# EAGLE board board2-d (EAGLE 6.6.0), part 1 of 2
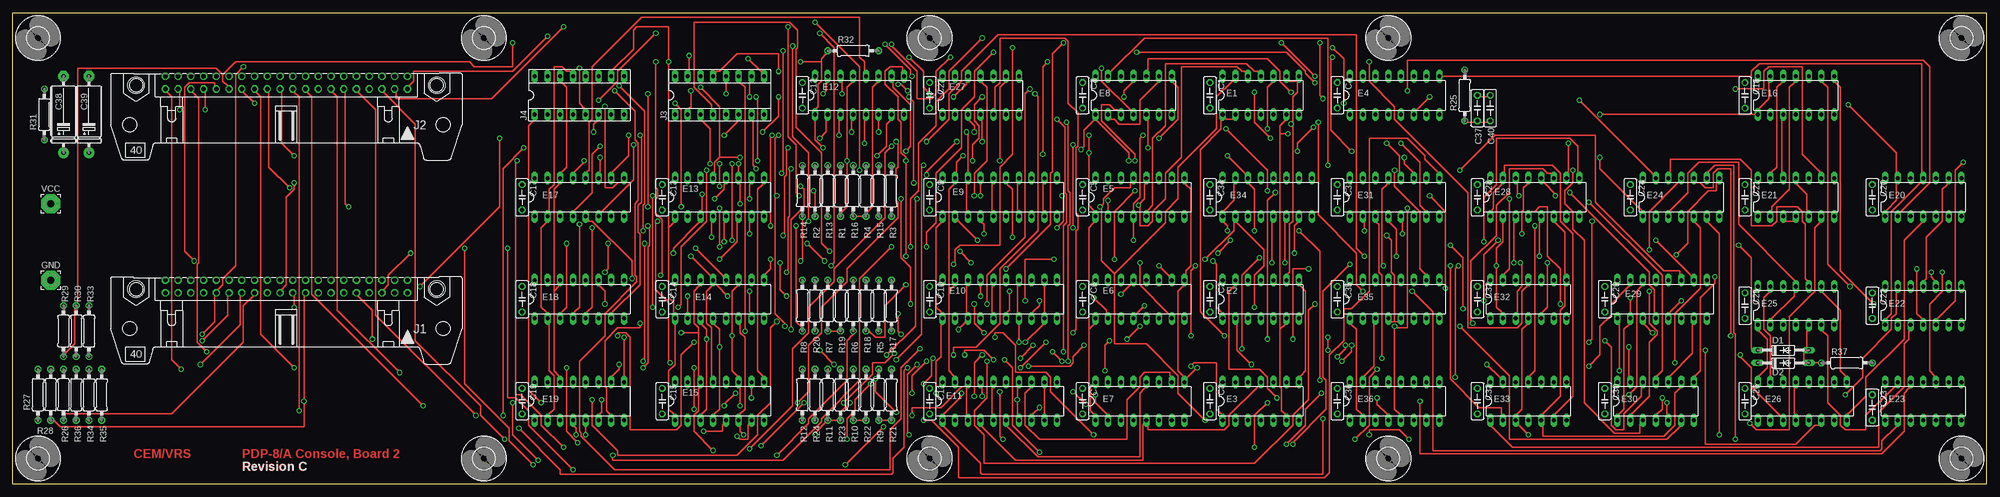
[diagram p4: board, top side]
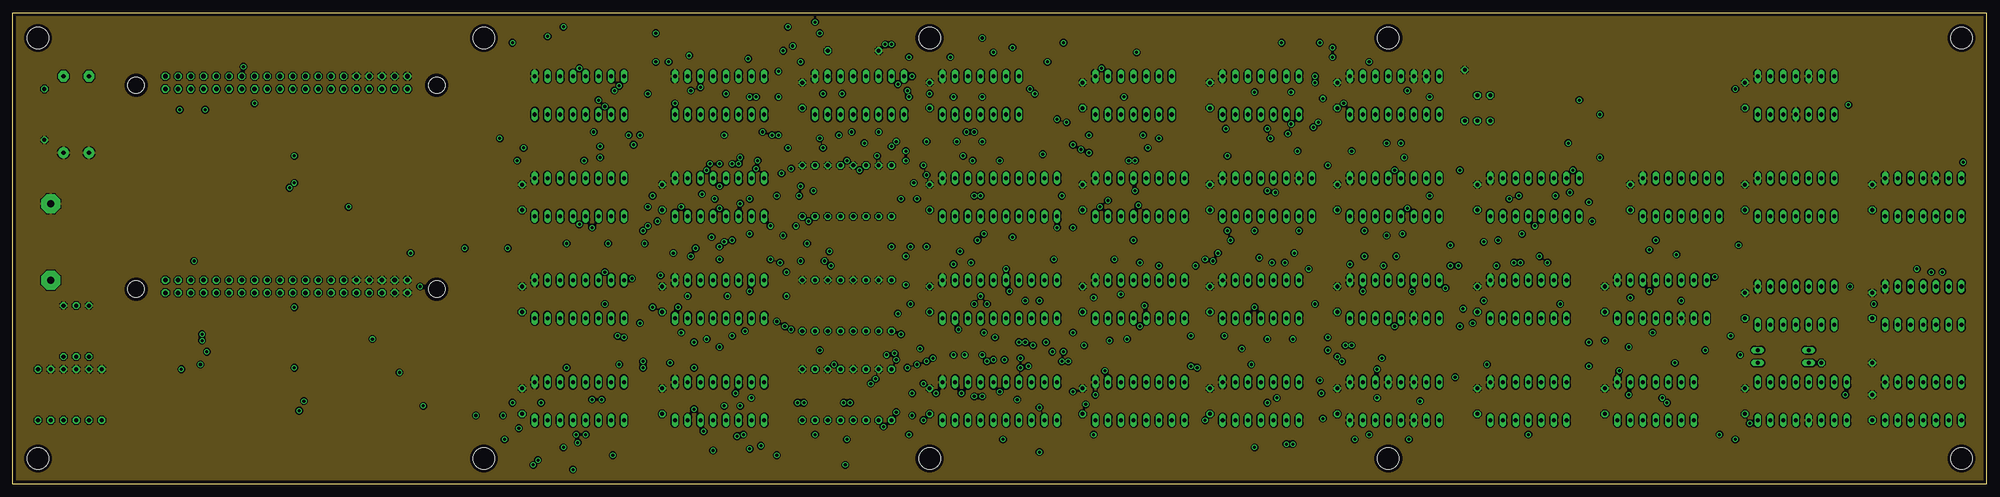
[diagram p5: board, inner layer VCC$]
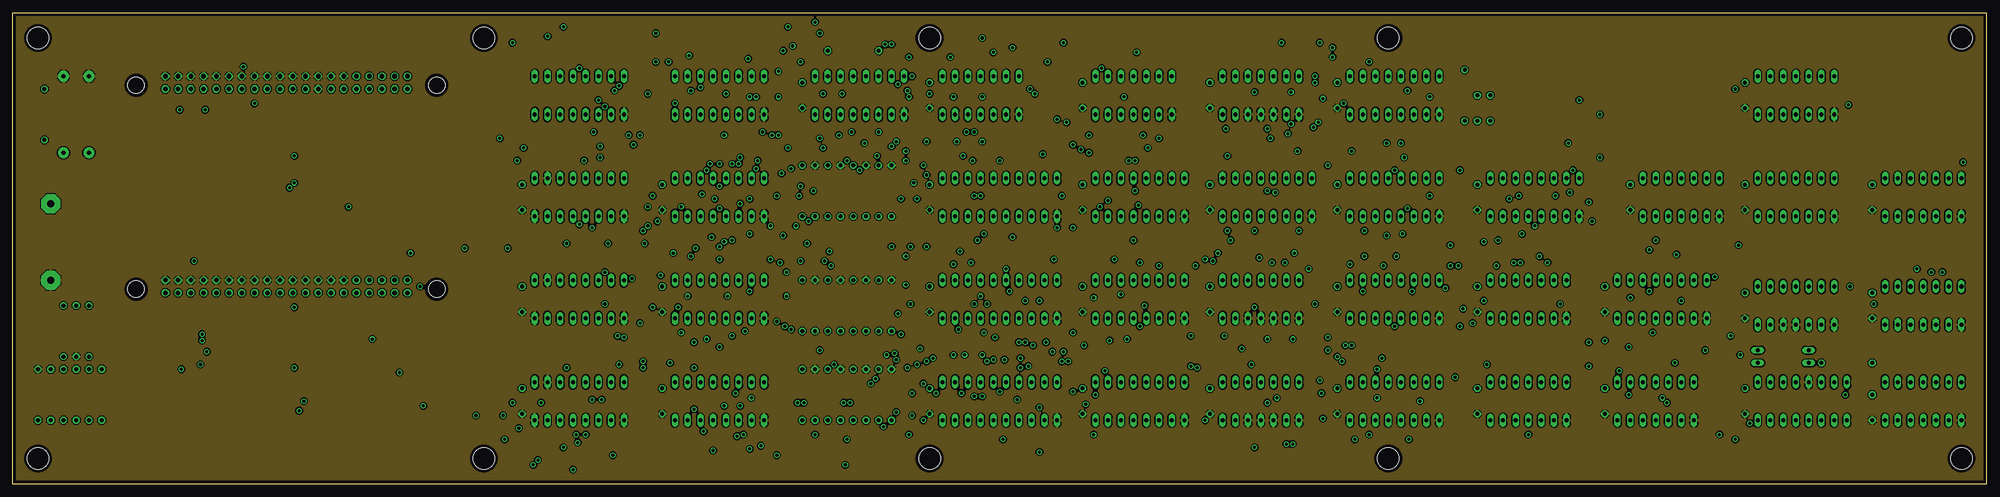
[diagram p6: board, inner layer GND$]
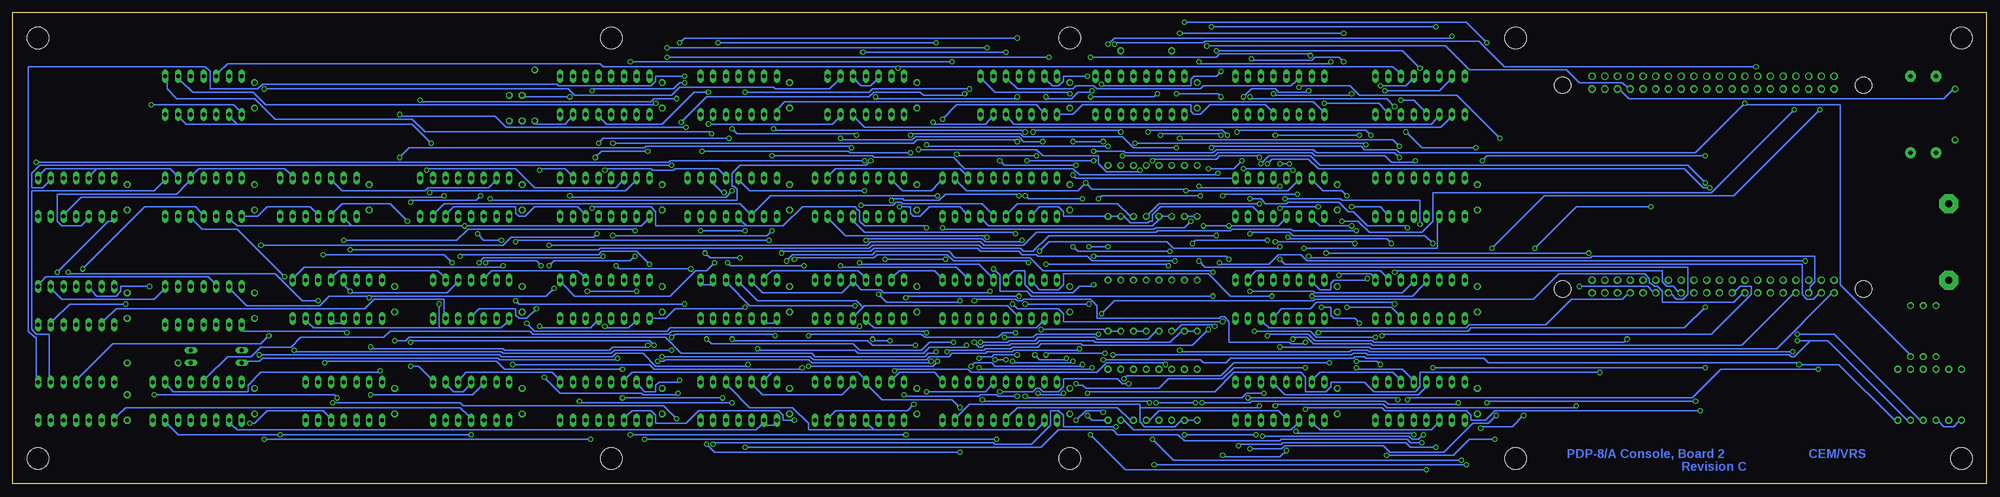
[diagram p7: board, bottom side, seen from below]

Size 393.7 x 93.98 mm. Coordinates in mm from the lower left corner, seen from the top.
Outline: 0,0 0,93.98 393.7,93.98 393.7,0 0,0
Copper layers (1*2*3*16): Top 0.035mm / dielectric 1.5mm / VCC$ 0.035mm / dielectric 0.15mm / GND$ 0.035mm / dielectric 0.2mm / Bottom 0.035mm
Design rules "10mils *": minimum track width 10mil, minimum drill 24mil, track to track 10mil, track to pad 10mil, pad to pad 10mil, via to via 10mil, smd to smd 10mil, copper to edge 25mil, drill to drill 10mil, minimum pad ring 10mil, minimum via ring 8mil, stop-mask expansion 0mil, vias tented up to drill 0mil, thermal gap 10mil
Net classes: 1 Supply: width 0.508 mm

## Footprints (pad centres in the part's own frame; a part is rotated, then mirrored left to right if it is on the bottom)
C050-025X075 = drill 0.813 octagon: 1 -2.54,0; 2 2.54,0
E15-5 = drill 0.813 pad 2.159: + -7.62,0 | drill 0.813 pad 2.159 octagon: - 7.62,0
DO35-10 = drill 0.813 long: A 5.08,0; C -5.08,0
DIL14 = drill 0.813 long: 1 -7.62,-3.81; 2 -5.08,-3.81; 3 -2.54,-3.81; 4 0,-3.81; 5 2.54,-3.81; 6 5.08,-3.81; 7 7.62,-3.81; 8 7.62,3.81; 9 5.08,3.81; 10 2.54,3.81; 11 0,3.81; 12 -2.54,3.81; 13 -5.08,3.81; 14 -7.62,3.81
DIL16 = drill 0.813 long: 1 -8.89,-3.81; 2 -6.35,-3.81; 3 -3.81,-3.81; 4 -1.27,-3.81; 5 1.27,-3.81; 6 3.81,-3.81; 7 6.35,-3.81; 8 8.89,-3.81; 9 8.89,3.81; 10 6.35,3.81; 11 3.81,3.81; 12 1.27,3.81; 13 -1.27,3.81; 14 -3.81,3.81; 15 -6.35,3.81; 16 -8.89,3.81
DIL20 = drill 0.813 long: 1 -11.43,-3.81; 2 -8.89,-3.81; 3 -6.35,-3.81; 4 -3.81,-3.81; 5 -1.27,-3.81; 6 1.27,-3.81; 7 3.81,-3.81; 8 6.35,-3.81; 9 8.89,-3.81; 10 11.43,-3.81; 11 11.43,3.81; 12 8.89,3.81; 13 6.35,3.81; 14 3.81,3.81; 15 1.27,3.81; 16 -1.27,3.81; 17 -3.81,3.81; 18 -6.35,3.81; 19 -8.89,3.81; 20 -11.43,3.81
3,81/1,4 = drill 1.397 pad 3.81 octagon: 1 0,0
40H = drill 0.914: 1 -24.13,-1.27 | drill 0.914 octagon: 2 -24.13,1.27; 3 -21.59,-1.27; 4 -21.59,1.27; 5 -19.05,-1.27; 6 -19.05,1.27; 7 -16.51,-1.27; 8 -16.51,1.27; 9 -13.97,-1.27; 10 -13.97,1.27; 11 -11.43,-1.27; 12 -11.43,1.27; 13 -8.89,-1.27; 14 -8.89,1.27; 15 -6.35,-1.27; 16 -6.35,1.27; 17 -3.81,-1.27; 18 -3.81,1.27; 19 -1.27,-1.27; 20 -1.27,1.27; 21 1.27,-1.27; 22 1.27,1.27; 23 3.81,-1.27; 24 3.81,1.27; 25 6.35,-1.27; 26 6.35,1.27; 27 8.89,-1.27; 28 8.89,1.27; 29 11.43,-1.27; 30 11.43,1.27; 31 13.97,-1.27; 32 13.97,1.27; 33 16.51,-1.27; 34 16.51,1.27; 35 19.05,-1.27; 36 19.05,1.27; 37 21.59,-1.27; 38 21.59,1.27; 39 24.13,-1.27; 40 24.13,1.27 | hole 3.302: -29.972,0.533; 29.972,0.533
SOCKED-16 = drill 0.813 long: 1 -8.89,-3.81; 2 -6.35,-3.81; 3 -3.81,-3.81; 4 -1.27,-3.81; 5 1.27,-3.81; 6 3.81,-3.81; 7 6.35,-3.81; 8 8.89,-3.81; 9 8.89,3.81; 10 6.35,3.81; 11 3.81,3.81; 12 1.27,3.81; 13 -1.27,3.81; 14 -3.81,3.81; 15 -6.35,3.81; 16 -8.89,3.81
0207/10 = drill 0.813 octagon: 1 -5.08,0; 2 5.08,0
4,3 = hole 4.3: 0,0

## Placement (x,y rotation side)
C1  [C050-025X075]  238.76,77.47 270 top
C2  [C050-025X075]  238.76,36.83 270 top
C3  [C050-025X075]  238.76,16.51 270 top
C4  [C050-025X075]  264.16,77.47 270 top
C5  [C050-025X075]  213.36,57.15 270 top
C6  [C050-025X075]  213.36,36.83 270 top
C7  [C050-025X075]  213.36,16.51 270 top
C8  [C050-025X075]  213.36,77.47 270 top
C9  [C050-025X075]  182.88,57.15 270 top
C10  [C050-025X075]  182.88,36.83 270 top
C11  [C050-025X075]  182.88,16.51 270 top
C12  [C050-025X075]  157.48,77.47 270 top
C13  [C050-025X075]  129.54,57.15 270 top
C14  [C050-025X075]  129.54,36.83 270 top
C15  [C050-025X075]  129.54,16.51 270 top
C16  [C050-025X075]  345.44,77.47 270 top
C17  [C050-025X075]  101.6,57.15 270 top
C18  [C050-025X075]  101.6,36.83 270 top
C19  [C050-025X075]  101.6,16.51 270 top
C20  [C050-025X075]  370.84,57.15 270 top
C21  [C050-025X075]  345.44,57.15 270 top
C22  [C050-025X075]  370.84,35.56 270 top
C23  [C050-025X075]  370.84,15.24 270 top
C24  [C050-025X075]  322.58,57.15 270 top
C25  [C050-025X075]  345.44,35.56 270 top
C26  [C050-025X075]  345.44,16.51 270 top
C27  [C050-025X075]  182.88,77.47 270 top
C28  [C050-025X075]  292.1,57.15 270 top
C29  [C050-025X075]  317.5,36.83 270 top
C30  [C050-025X075]  317.5,16.51 270 top
C31  [C050-025X075]  264.16,57.15 270 top
C32  [C050-025X075]  292.1,36.83 270 top
C33  [C050-025X075]  292.1,16.51 270 top
C34  [C050-025X075]  238.76,57.15 270 top
C35  [C050-025X075]  264.16,36.83 270 top
C36  [C050-025X075]  264.16,16.51 270 top
C37  10  [C050-025X075]  292.1,74.93 90 top
C38  6.8uf  [E15-5]  10.16,73.66 90 top
C39  6.8uf  [E15-5]  15.24,73.66 90 top
C40  47  [C050-025X075]  294.64,74.93 90 top
D1  1N4148  [DO35-10]  353.06,26.67 0 top
D2  1N4148  [DO35-10]  353.06,24.13 0 top
E1  74LS95N  [DIL14]  248.92,77.47 0 top
E2  74LS95N  [DIL14]  248.92,36.83 0 top
E3  74LS95N  [DIL14]  248.92,16.51 0 top
E4  74LS123N  [DIL16]  275.59,77.47 0 top
E5  74LS175N  [DIL16]  224.79,57.15 0 top
E6  74LS175N  [DIL16]  224.79,36.83 0 top
E7  74LS175N  [DIL16]  224.79,16.51 0 top
E8  74LS00N  [DIL14]  223.52,77.47 0 top
E9  74LS244N  [DIL20]  196.85,57.15 0 top
E10  74LS244N  [DIL20]  196.85,36.83 0 top
E11  74LS244N  [DIL20]  196.85,16.51 0 top
E12  74LS174N  [DIL16]  168.91,77.47 0 top
E13  74LS174N  [DIL16]  140.97,57.15 0 top
E14  74LS174N  [DIL16]  140.97,36.83 0 top
E15  74LS174N  [DIL16]  140.97,16.51 0 top
E16  74LS74N  [DIL14]  355.6,77.47 0 top
E17  74LS153N  [DIL16]  113.03,57.15 0 top
E18  74LS153N  [DIL16]  113.03,36.83 0 top
E19  74LS153N  [DIL16]  113.03,16.51 0 top
E20  74LS74N  [DIL14]  381,57.15 0 top
E21  74LS27N  [DIL14]  355.6,57.15 0 top
E22  74LS02N  [DIL14]  381,35.56 0 top
E23  7416N  [DIL14]  381,16.51 0 top
E24  74LS04N  [DIL14]  332.74,57.15 0 top
E25  74LS27N  [DIL14]  355.6,35.56 0 top
E26  74LS75N  [DIL16]  356.87,16.51 0 top
E27  7404N  [DIL14]  193.04,77.47 0 top
E28  74LS367N  [DIL16]  303.53,57.15 0 top
E29  74LS138N  [DIL16]  328.93,36.83 0 top
E30  74LS00N  [DIL14]  327.66,16.51 0 top
E31  74LS367N  [DIL16]  275.59,57.15 0 top
E32  74LS08N  [DIL14]  302.26,36.83 0 top
E33  74LS02N  [DIL14]  302.26,16.51 0 top
E34  74LS367N  [DIL16]  250.19,57.15 0 top
E35  74LS138N  [DIL16]  275.59,36.83 0 top
E36  74LS174N  [DIL16]  275.59,16.51 0 top
GND  [3,81/1,4]  7.62,40.64 0 top
J1  [40H]  54.61,39.37 180 top
J2  [40H]  54.61,80.01 180 top
J3  [SOCKED-16]  140.97,77.47 0 top
J4  [SOCKED-16]  113.03,77.47 0 top
R1  680  [0207/10]  165.1,58.42 270 top
R2  680  [0207/10]  160.02,58.42 270 top
R3  680  [0207/10]  175.26,58.42 270 top
R4  680  [0207/10]  170.18,58.42 270 top
R5  330  [0207/10]  172.72,35.56 90 top
R6  330  [0207/10]  167.64,35.56 90 top
R7  330  [0207/10]  162.56,35.56 90 top
R8  330  [0207/10]  157.48,35.56 90 top
R9  330  [0207/10]  172.72,17.78 90 top
R10  330  [0207/10]  167.64,17.78 90 top
R11  330  [0207/10]  162.56,17.78 90 top
R12  330  [0207/10]  157.48,17.78 90 top
R13  330  [0207/10]  162.56,58.42 90 top
R14  330  [0207/10]  157.48,58.42 90 top
R15  330  [0207/10]  172.72,58.42 90 top
R16  330  [0207/10]  167.64,58.42 90 top
R17  680  [0207/10]  175.26,35.56 270 top
R18  680  [0207/10]  170.18,35.56 270 top
R19  680  [0207/10]  165.1,35.56 270 top
R20  680  [0207/10]  160.02,35.56 270 top
R21  680  [0207/10]  175.26,17.78 270 top
R22  680  [0207/10]  170.18,17.78 270 top
R23  680  [0207/10]  165.1,17.78 270 top
R24  680  [0207/10]  160.02,17.78 270 top
R25  6K8  [0207/10]  289.56,77.47 270 top
R26  180  [0207/10]  10.16,17.78 90 top
R27  390  [0207/10]  5.08,17.78 270 top
R28  1K  [0207/10]  7.62,17.78 90 top
R29  180  [0207/10]  10.16,30.48 90 top
R30  390  [0207/10]  12.7,30.48 90 top
R31  1K  [0207/10]  6.35,73.66 270 top
R32  1K  [0207/10]  167.64,86.36 0 top
R33  1K  [0207/10]  15.24,30.48 90 top
R34  1K  [0207/10]  15.24,17.78 270 top
R35  1K  [0207/10]  17.78,17.78 270 top
R36  1K  [0207/10]  12.7,17.78 270 top
R37  10K  [0207/10]  365.76,24.13 0 top
U$11  [4,3]  93.98,88.9 0 top
U$12  [4,3]  5.08,88.9 0 top
U$13  [4,3]  182.88,88.9 0 top
U$14  [4,3]  274.32,88.9 0 top
U$15  [4,3]  388.62,88.9 0 top
U$16  [4,3]  388.62,5.08 0 top
U$17  [4,3]  274.32,5.08 0 top
U$18  [4,3]  182.88,5.08 0 top
U$19  [4,3]  93.98,5.08 0 top
U$20  [4,3]  5.08,5.08 0 top
VCC  [3,81/1,4]  7.62,55.88 0 top

## Tracks (layer width: path | path; a pad name or v marks a point on that pad's centre or on a via)
!ADRLTH  (via drill 0.61)
  Top 0.254: v151.13,44.77 151.13,42.86 150.18,41.91 E14.9 | v178.12,45.4 v178.12,64.45 178.12,65.09 177.16,66.04 177.16,72.07 176.53,72.71 176.53,77.15 173.99,79.69 173.99,82.23 174.94,83.19 177.48,83.19 177.48,82.55 E12.9 | v221.62,77.15 221.62,78.42 223.2,80.01 E8.11 | v193.36,77.15 191.77,75.56 191.77,72.39 192.72,71.44 192.72,68.9 191.45,67.63 v191.45,64.45
  Bottom 0.254: v151.13,44.77 151.76,45.4 v178.12,45.4 | v221.62,77.15 221.3,76.83 193.68,76.83 v193.36,77.15 | v191.45,64.45 v178.12,64.45
!BFSW  (via drill 0.61)
  Top 0.254: v293.37,48.26 293.37,57.15 295.91,59.69 295.91,68.9 310.51,68.9 312.1,67.31 312.1,62.23 E28.9 | v240.35,46.04 v242.89,48.58 | v161.93,44.45 v158.43,47.94 | v143.51,48.58 v143.51,63.82 | v55.24,59.05 51.12,63.18 51.12,78.11 J2.24
  Bottom 0.254: v293.37,48.26 293.05,48.58 v242.89,48.58 | v240.35,46.04 240.03,46.35 222.57,46.35 221.93,46.99 201.29,46.99 200.66,46.35 193.04,46.35 192.41,45.72 189.55,45.72 189.23,45.4 179.39,45.4 178.44,44.45 v161.93,44.45 | v158.43,47.94 157.8,48.58 v143.51,48.58 | v143.51,63.82 142.56,64.77 135.25,64.77 133.35,62.87 60.33,62.87 56.52,59.05 v55.24,59.05
!BKDTACNTL  (via drill 0.61)
  Top 0.254: v299.4,44.13 299.4,52.07 E28.3 | v288.29,43.5 287.65,42.86 v287.65,21.27 | v260.99,18.1 257.81,14.92 257.81,11.75 v254,7.94 | v173.67,11.43 v166.05,3.81 | v103.82,3.81 99.06,8.57 99.06,11.11 90.17,20 v90.17,46.99 | v66.99,55.24 66.36,55.88 66.36,78.11 J2.12
  Bottom 0.254: v299.4,44.13 299.08,44.45 289.24,44.45 v288.29,43.5 | v287.65,21.27 284.48,18.1 268.29,18.1 267.97,17.78 261.3,17.78 v260.99,18.1 | v254,7.94 253.68,8.26 198.12,8.26 197.8,7.94 190.5,7.94 186.69,11.75 186.69,14.61 185.1,14.61 184.15,13.65 184.15,11.43 v173.67,11.43 | v166.05,3.81 v103.82,3.81 | v90.17,46.99 81.92,55.24 v66.99,55.24
!BOOTF  (via drill 0.61)
  Top 0.254: v310.2,67.94 310.2,62.23 E28.10
  Bottom 0.254: v310.2,67.94 314.01,71.75 348.93,71.75 | 348.93,71.75 349.88,72.71 E16.2 | 348.93,71.75 359.09,71.75 360.05,72.71 E16.6
!BUSEN  (via drill 0.61)
  Top 0.254: v223.84,58.42 219.71,54.29 v219.71,44.77 | v207.65,44.77 201.93,44.77 v201.93,36.51 | v135.89,28.26 133.35,25.72 133.35,11.75 132.4,10.79 123.19,10.79 123.19,29.21 122.24,30.16 120.65,30.16 v120.65,29.53
  Bottom 0.254: v223.84,58.42 246.7,58.42 248.28,60.01 E34.13 | v219.71,44.77 v207.65,44.77 | v201.93,36.51 201.61,36.83 193.68,36.83 193.36,36.51 192.41,36.51 192.09,36.83 178.75,36.83 177.48,35.56 177.48,33.02 153.03,33.02 152.72,33.34 152.08,33.34 151.13,32.38 151.13,28.26 139.06,28.26 138.75,27.94 136.21,27.94 v135.89,28.26 | v120.65,29.53 120.33,29.84 54.93,29.84 46.99,37.78 46.99,39.37 49.21,39.37 50.16,38.42 J1.24
!DEP  (via drill 0.61)
  Top 0.254: v304.48,45.4 304.48,52.07 E28.5 | v266.7,43.81 261.3,38.42 261.3,21.27 261.94,20.64 261.94,14.92 255.27,8.26 v255.27,7.94 | v204.79,6.35 199.39,11.75 199.39,23.18 v197.8,24.77 | v195.58,24.77 193.68,26.67 189.87,26.67 v189.87,25.72 | v183.51,25.08 183.2,24.77 183.2,21.59 v181.61,20 | v135.89,23.18 v135.89,14.92 | v57.15,14.61 57.15,77.15 56.2,78.11 J2.20
  Bottom 0.254: v304.48,45.4 304.17,45.72 276.86,45.72 276.23,46.35 269.24,46.35 v266.7,43.81 | v255.27,7.94 253.68,6.35 v204.79,6.35 | v197.8,24.77 v195.58,24.77 | v189.87,25.72 188.91,24.77 183.83,24.77 v183.51,25.08 | v181.61,20 181.29,19.68 180.34,19.68 179.71,19.05 165.1,19.05 163.19,20.95 152.4,20.95 150.18,23.18 v135.89,23.18 | v135.89,14.92 135.57,15.24 120.65,15.24 120.02,14.61 103.82,14.61 102.87,13.65 102.87,12.7 100.01,12.7 98.11,14.61 v57.15,14.61
!DSPLTH  (via drill 0.61)
  Top 0.254: E15.9 149.54,21.59 148.59,22.54 148.59,58.74 149.54,59.69 E13.9 | v228.6,68.9 232.41,72.71 232.41,79.06 231.46,80.01 E8.8 | v188.28,68.26 182.25,62.23 v182.25,61.59
  Bottom 0.254: v228.6,68.9 228.28,68.58 214.31,68.58 213.68,69.22 193.04,69.22 192.09,68.26 v188.28,68.26 | v182.25,61.59 181.61,60.96 E13.9
!EMA0  (via drill 0.61)
  Top 0.254: v37.78,28.57 42.86,33.66 42.86,37.47 J1.30 | v191.77,57.47 191.77,61.91 194.31,64.45 194.31,79.06 193.36,80.01 E27.11 | v180.34,56.83 180.02,56.52 180.02,31.43 v174.31,25.72
  Bottom 0.254: 35.24,28.57 v37.78,28.57 | 35.24,28.57 31.75,28.57 15.88,12.7 R34.2 | v191.77,57.47 191.13,56.83 v180.34,56.83 | v174.31,25.72 126.68,25.72 126.36,26.04 123.83,26.04 123.51,25.72 39.37,25.72 39.05,25.4 38.42,25.4 35.24,28.57
!EMA1  (via drill 0.61)
  Top 0.254: v37.47,23.81 45.4,31.75 45.4,37.47 J1.28 | v196.85,64.45 196.85,79.06 197.8,80.01 E27.9 | v181.61,63.5 181.29,63.18 181.29,29.84 v176.21,24.77
  Bottom 0.254: R35.2 18.41,12.7 29.53,23.81 v37.47,23.81 37.78,24.13 99.38,24.13 100.33,25.08 123.83,25.08 124.14,25.4 126.05,25.4 126.36,25.08 150.81,25.08 151.76,24.13 156.21,24.13 156.84,24.77 v176.21,24.77 | v196.85,64.45 195.9,63.5 v181.61,63.5
!EMA2  (via drill 0.61)
  Top 0.254: v37.78,29.84 40.32,32.38 40.32,37.47 J1.32 40.96,38.73 41.91,39.69 41.91,40.96 44.45,43.5 44.45,81.6 v46.04,83.19 | v179.39,81.28 179.07,81.6 179.07,82.55 v173.99,87.63
  Bottom 0.254: v37.78,29.84 30.48,29.84 13.34,12.7 R36.2 | v179.39,81.28 184.15,81.28 184.15,80.33 185.1,79.38 186.37,79.38 187.32,80.33 E27.13 | v173.99,87.63 173.67,87.95 156.21,87.95 155.89,88.27 101.28,88.27 96.2,83.19 v46.04,83.19
!EMODE  (via drill 0.61)
  Top 0.254: 252.73,30.8 252.73,19.37 253.05,19.05 253.05,14.61 253.68,13.97 E3.6 | 252.73,30.8 253.68,31.75 E2.6 | 252.73,30.8 252.73,69.85 | 252.73,69.85 252.73,71.44 253.68,72.39 E1.6 | v371.16,35.88 364.49,42.55 364.49,79.06 363.54,80.01 E16.8 | 252.73,69.85 v254.32,69.85
  Bottom 0.254: v371.16,35.88 382.27,35.88 385.44,32.7 E22.6 | v254.32,69.85 254.63,70.17 311.47,70.17 314.01,72.71 341.31,72.71 345.44,76.83 361,76.83 362.9,78.74 362.9,80.01 E16.8
!FUN  (via drill 0.61)
  Top 0.254: E25.2 350.84,33.02 355.28,37.47 355.28,38.1 E25.11 355.28,40.64 344.17,51.75 344.17,64.14 336.23,64.14 334.01,61.91 334.01,58.1 330.52,54.61 E24.3 | v120.02,78.42 124.14,74.3 124.14,68.58 124.78,67.94 124.78,56.52 124.14,55.88 124.14,41.59 124.46,41.27 124.46,40.32 118.11,33.97 118.11,29.53 113.03,24.45 113.03,10.48 113.35,10.16 113.35,9.53 120.02,2.86 174.94,2.86 174.94,10.79 177.16,13.02 177.16,23.18 v180.97,26.99 | v264.16,25.4 265.75,26.99 v265.75,27.62 | v314.32,28.26 314.96,28.89 v314.96,52.39
  Bottom 0.254: v120.02,78.42 109.22,78.42 107.31,80.33 J4.15 | v180.97,26.99 181.29,26.67 193.99,26.67 194.31,26.35 199.39,26.35 199.71,26.04 206.38,26.04 207.01,25.4 210.82,25.4 211.46,24.77 234,24.77 234.63,25.4 v264.16,25.4 | v265.75,27.62 266.7,28.57 314.01,28.57 v314.32,28.26 | v314.96,52.39 318.45,55.88 327.98,55.88 329.56,54.29 E24.3
!GATEENT  (via drill 0.61)
  Top 0.254: v189.23,18.1 189.23,17.46 185.74,13.97 E11.1 185.74,11.43 193.04,4.13 193.04,2.22 193.36,1.91 261.3,1.91 v261.3,13.02 | v184.15,18.1 184.15,24.45 185.1,25.4 185.1,31.75 E10.1 185.1,34.29 184.15,35.24 184.15,51.12 185.1,52.07 E9.1 | v346.39,12.06 347.66,10.79 354.33,10.79 354.33,33.34 359.41,38.42 359.41,51.12 360.36,52.07 E21.6 | v329.88,16.19 329.88,13.97 E30.5
  Bottom 0.254: v189.23,18.1 188.91,17.78 184.47,17.78 v184.15,18.1 | v346.39,12.06 345.44,12.06 342.9,14.61 331.79,14.61 330.83,13.65 E30.5 | v261.3,13.02 263.84,15.56 303.85,15.56 304.48,16.19 v329.88,16.19
!GATESR  (via drill 0.61)
  Top 0.254: 186.69,38.42 186.69,22.54 187.64,21.59 E11.19 | 186.69,38.42 187.64,39.37 E10.19 | 186.69,38.42 186.69,58.74 187.64,59.69 E9.19 188.28,62.23 188.28,64.14 v189.55,65.41 | v270.51,84.14 270.51,80.33 275.59,75.25 275.59,72.71 290.19,58.1 290.19,31.11 300.04,31.11 300.99,32.07 300.99,38.42 301.94,39.37 E32.11 | v206.38,84.14 205.42,83.19 v205.42,65.72
  Bottom 0.254: v206.38,84.14 v270.51,84.14 | v205.42,65.72 205.1,65.41 v189.55,65.41
!IND1  (via drill 0.61)
  Top 0.254: v155.57,87.31 155.57,69.22 158.75,66.04 v158.75,52.39 | v208.28,51.12 209.55,52.39 209.55,57.15 v209.23,57.47
  Bottom 0.254: E28.7 309.25,54.29 307.66,55.88 248.6,55.88 247.01,54.29 E34.3 245.75,54.29 242.57,57.47 v209.23,57.47 | v155.57,87.31 107.95,87.31 103.19,82.55 83.82,82.55 81.28,80.01 72.71,80.01 71.75,79.06 J2.8 | v158.75,52.39 160.02,51.12 165.74,51.12 166.05,50.8 207.96,50.8 v208.28,51.12
!IND2  (via drill 0.61)
  Top 0.254: v251.14,44.13 251.14,52.07 E34.5 | v235.9,43.5 234.95,42.55 v234.95,29.53 | v193.68,30.16 191.77,32.07 v191.77,35.88 | v179.07,35.88 179.07,43.18 177.16,45.09 v177.16,56.83 | v156.84,57.47 156.21,58.1 156.21,67.63 154.62,69.22 v154.62,91.12 | v109.86,91.12 95.57,76.83 76.52,76.83 76.52,78.11 J2.4
  Bottom 0.254: v251.14,44.13 250.51,43.5 v235.9,43.5 | v234.95,29.53 234.63,29.84 212.41,29.84 211.77,29.21 197.17,29.21 196.22,30.16 v193.68,30.16 | v191.77,35.88 v179.07,35.88 | v177.16,56.83 176.53,57.47 v156.84,57.47 | v154.62,91.12 v109.86,91.12
!INIT  (via drill 0.61)
  Top 0.254: v181.61,12.7 183.2,12.7 188.59,7.3 188.59,1.27 261.62,1.27 262.57,2.22 262.57,25.72 265.43,28.57 265.43,34.92 267.02,34.92 270.51,38.42 270.51,68.9 278.13,68.9 281.62,65.41 281.62,64.77 284.16,62.23 E31.9 | v176.21,14.29 172.09,18.41 v172.09,20.95 | v131.13,24.13 130.81,24.45 130.81,36.2 128.27,38.73 128.27,52.07 v128.59,52.39 | v38.42,74.61 38.42,78.11 J2.34
  Bottom 0.254: v181.61,12.7 179.71,14.61 176.53,14.61 v176.21,14.29 | v172.09,20.95 171.45,21.59 152.72,21.59 150.18,24.13 v131.13,24.13 | v128.59,52.39 125.41,52.39 123.19,50.16 112.71,50.16 110.49,52.39 110.49,58.1 54.93,58.1 v38.42,74.61
!KEY-F  (via drill 0.61)
  Top 0.254: E26.4 355.28,13.97 355.28,19.05 E26.13 | v211.46,30.16 212.09,30.8 212.09,50.48 212.41,50.8 212.41,53.66 212.09,53.98 212.09,66.99 212.41,67.31 212.41,73.98 210.5,75.88 210.5,88.27 209.87,88.9 196.85,88.9 196.85,80.01 195.9,79.06 195.9,74.93 E27.5
  Bottom 0.254: J4.3 109.86,72.71 110.81,71.75 193.99,71.75 194.94,72.71 E27.5 | v211.46,30.16 211.77,30.48 262.25,30.48 262.89,29.84 289.88,29.84 290.51,30.48 318.45,30.48 319.72,29.21 336.23,29.21 338.14,27.3 344.17,27.3 346.07,25.4 350.84,25.4 354.96,21.27 E26.13
!KEYCNTL  (via drill 0.61)
  Top 0.254: v273.37,43.5 273.05,43.81 273.05,58.74 274,59.69 E31.13 | v258.44,42.86 255.27,42.86 v255.27,28.89 | v206.06,28.26 v200.98,23.18 | v178.44,23.18 177.8,22.54 177.8,7.3 175.58,5.08 175.58,2.22 175.26,1.91 109.22,1.91 109.22,2.86 v100.97,11.11 | v92.39,13.65 72.39,33.66 72.39,74.61 68.9,78.11 J2.10
  Bottom 0.254: v273.37,43.5 272.73,42.86 v258.44,42.86 | v255.27,28.89 254.32,27.94 226.06,27.94 224.79,26.67 212.41,26.67 210.82,28.26 v206.06,28.26 | v200.98,23.18 200.66,22.86 178.75,22.86 v178.44,23.18 | v100.97,11.11 100.65,11.43 94.61,11.43 v92.39,13.65
!KEYSTB  (via drill 0.61)
  Top 0.254: E16.11 355.28,80.01 354.33,79.06 354.33,58.74 350.84,55.24 350.84,54.61 E21.2 | v303.53,51.44 303.53,22.54 302.58,21.59 E33.11
  Bottom 0.254: E33.11 302.89,19.37 303.85,18.41 305.75,18.41 306.7,19.37 E33.9 | 326.07,51.44 v303.53,51.44 268.29,51.44 267.33,52.39 E31.1 | 326.07,51.44 327.02,52.39 E24.2 | 326.07,51.44 348.93,51.44 349.88,52.39 E21.2
!KFUN0  (via drill 0.61)
  Top 0.254: v139.06,63.82 139.06,70.8 137.48,72.39 J3.3 | v140.97,59.37 v140.97,63.82 | v157.16,59.37 157.8,58.74 157.8,55.24 155.26,52.7 v155.26,30.8 | v209.23,24.45 v207.33,26.35 | v234.95,23.5 235.59,24.13 240.03,24.13 240.03,14.92 240.98,13.97 E3.1
  Bottom 0.254: E3.1 241.94,11.75 243.21,11.75 E3.2 244.47,11.75 245.43,10.79 348.93,10.79 349.88,11.75 E26.2 | v140.97,63.82 v139.06,63.82 | v140.97,59.37 141.29,59.05 156.84,59.05 v157.16,59.37 | v155.26,30.8 158.43,27.62 180.34,27.62 180.66,27.94 188.59,27.94 189.23,27.3 194.31,27.3 194.63,26.99 199.71,26.99 200.03,26.67 207.01,26.67 v207.33,26.35 | v209.23,24.45 210.19,23.5 v234.95,23.5
!KFUN1  (via drill 0.61)
  Top 0.254: v344.49,25.72 344.49,25.4 346.71,23.18 346.71,19.37 352.43,13.65 E26.3 | v247.01,23.81 244.16,26.67 244.16,31.75 E2.2 | v135.25,78.42 135.25,75.25 134.94,74.93 J3.2 | v148.27,77.15 148.59,76.83 v148.59,64.45 | v155.26,62.87 154.94,62.55 154.94,53.34 154.62,53.02 154.62,42.55 v154.31,42.23 | v239.4,44.45 240.03,43.81 240.03,35.24 240.98,34.29 E2.1
  Bottom 0.254: E2.1 241.94,32.07 243.21,32.07 E2.2 | v344.49,25.72 296.55,25.72 296.23,25.4 274,25.4 273.37,26.04 267.97,26.04 265.43,23.5 247.33,23.5 v247.01,23.81 | v135.25,78.42 135.57,78.11 141.29,78.11 141.92,78.74 146.69,78.74 v148.27,77.15 | v148.59,64.45 150.18,62.87 v155.26,62.87 | v154.31,42.23 154.62,42.55 188.28,42.55 190.82,45.09 205.74,45.09 207.01,46.35 221.62,46.35 222.25,45.72 238.12,45.72 v239.4,44.45
!KFUN2  (via drill 0.61)
  Top 0.254: E1.2 243.21,72.71 241.94,72.71 E1.1 240.98,72.39 240.98,70.8 236.85,66.67 236.85,34.29 v241.62,29.53 | v337.5,26.67 337.5,7.94 355.6,7.94 359.41,11.75 360.05,11.75 E26.6 | v262.25,29.21 v262.25,26.67
  Bottom 0.254: J3.1 132.72,74.61 134.3,76.2 239.71,76.2 240.98,74.93 E1.1 | v337.5,26.67 337.19,26.35 296.23,26.35 295.91,26.04 274.32,26.04 273.69,26.67 v262.25,26.67 | v262.25,29.21 261.62,29.84 241.94,29.84 v241.62,29.53
!LAENAB  (via drill 0.61)
  Top 0.254: v279.08,38.42 283.21,34.29 283.21,6.67 372.43,6.67 372.75,6.99 372.75,8.57 375.6,11.43 E23.2 | v269.24,38.42 267.97,39.69 267.97,46.04 260.35,53.66 v260.35,72.07 | v203.84,77.79 204.47,77.15 204.47,50.48 196.85,42.86 196.85,32.07 192.09,27.3 187.64,27.3 v187.64,25.72 | v175.9,26.04 173.99,24.13 171.45,24.13 171.45,21.91 v165.74,16.19 | v157.8,16.19 v149.22,7.62 | v109.86,7.3 105.41,11.75 105.41,13.65 101.28,17.78 100.33,17.78 100.33,64.14 v100.65,64.45 | v56.2,65.41 53.66,67.94 53.66,78.11 J2.22
  Bottom 0.254: v269.24,38.42 v279.08,38.42 | v260.35,72.07 255.27,77.15 222.88,77.15 221.93,78.11 212.72,78.11 212.09,77.47 204.15,77.47 v203.84,77.79 | v187.64,25.72 187.32,26.04 v175.9,26.04 | v165.74,16.19 v157.8,16.19 | v149.22,7.62 148.91,7.94 140.65,7.94 140.34,8.26 115.89,8.26 114.94,7.3 v109.86,7.3 | v100.65,64.45 99.69,65.41 v56.2,65.41
!MAEN  (via drill 0.61)
  Top 0.254: v253.05,87.95 v259.71,81.28 | v209.55,87.95 207.33,85.72 207.33,62.23 207.01,61.91 207.01,51.75 v198.12,42.86 | v154.31,37.47 153.03,38.73 v153.03,44.13 | v36.2,44.45 34.29,46.35 34.29,79.06 35.24,80.01 40.32,80.01 40.32,79.38 J2.32
  Bottom 0.254: v259.71,81.28 265.43,81.28 265.43,80.33 266.38,79.38 284.8,79.38 285.12,79.69 343.85,79.69 344.81,78.74 354.33,78.74 354.33,82.23 355.28,83.19 390.52,83.19 390.52,30.48 389.25,29.21 388.94,29.21 388.94,21.59 E23.8 | v209.55,87.95 v253.05,87.95 | v198.12,42.86 196.85,41.59 196.85,38.42 191.45,38.42 190.5,37.47 v154.31,37.47 | v153.03,44.13 152.72,43.81 143.19,43.81 141.29,45.72 136.84,45.72 135.57,44.45 v36.2,44.45
!MALC  (via drill 0.61)
  Top 0.254: v291.15,32.07 290.83,32.38 290.83,44.45 295.91,49.53 295.91,55.56 298.45,58.1 298.45,62.87 305.12,62.87 306.07,61.91 306.7,61.91 E28.11 | v224.79,31.43 v222.25,28.89 | v218.76,28.57 217.81,27.62 v217.81,22.54 | v163.83,23.81 v160.97,26.67 | v38.73,26.35 36.83,28.26 36.83,43.81 37.15,44.13 37.15,76.83 35.88,78.11 J2.36
  Bottom 0.254: v291.15,32.07 289.56,30.48 263.21,30.48 262.57,31.11 225.11,31.11 v224.79,31.43 | v222.25,28.89 221.93,28.57 v218.76,28.57 | v217.81,22.54 217.49,22.86 203.2,22.86 202.56,22.23 177.48,22.23 175.58,24.13 164.15,24.13 v163.83,23.81 | v160.97,26.67 160.66,26.35 127,26.35 126.68,26.67 123.51,26.67 123.19,26.35 v38.73,26.35
!MCLOCK  (via drill 0.61)
  Top 0.254: v105.41,16.19 102.87,18.73 102.87,71.44 103.82,72.39 J4.1 | v156.53,16.19 158.75,18.41 158.75,27.62 161.29,30.16 161.29,35.24 166.37,40.32 166.37,42.86 176.53,53.02 176.53,56.2 176.21,56.52 176.21,62.87 176.53,63.18 176.53,67.94 v176.21,68.26 | v182.25,68.26 186.69,72.71 186.69,77.79 189.23,80.33 189.23,82.23 196.53,89.53 267.97,89.53 267.97,46.99 v269.56,45.4 | v286.7,43.5 286.7,20.95 292.42,15.24 296.86,15.24 296.86,13.97 E33.2
  Bottom 0.254: v105.41,16.19 105.73,15.88 119.38,15.88 120.02,16.51 146.69,16.51 147,16.19 v156.53,16.19 | v182.25,68.26 v176.21,68.26 | v269.56,45.4 270.51,44.45 285.75,44.45 v286.7,43.5
!MD  (via drill 0.61)
  Top 0.254: v255.59,46.04 255.59,51.44 256.22,52.07 E34.7 | v248.6,45.09 245.11,41.59 v245.11,26.99 | v203.52,27.62 v200.98,25.08 | v193.36,25.72 191.77,24.13 v191.77,17.46 | v144.15,18.1 141.92,15.88 v141.92,15.56 | v81.92,15.56 59.69,37.78 59.69,77.15 58.74,78.11 J2.18
  Bottom 0.254: v255.59,46.04 254.63,45.09 v248.6,45.09 | v245.11,26.99 244.79,26.67 225.74,26.67 225.11,26.04 212.09,26.04 210.82,27.3 203.84,27.3 v203.52,27.62 | v200.98,25.08 200.66,25.4 198.44,25.4 198.12,25.72 v193.36,25.72 | v191.77,17.46 191.45,17.14 148.59,17.14 147.64,18.1 v144.15,18.1 | v141.92,15.56 141.6,15.88 120.33,15.88 119.7,15.24 82.23,15.24 v81.92,15.56
!MEMSTART  (via drill 0.61)
  Top 0.254: v280.67,16.51 280.67,6.03 372.75,6.03 377.19,10.48 377.19,18.1 378.14,19.05 E23.12 | v250.19,16.19 247.65,13.65 v247.65,7.3 | v112.71,8.26 110.49,10.48 v110.49,23.18 | v56.2,23.18 49.53,29.84 49.53,77.15 48.58,78.11 J2.26
  Bottom 0.254: v280.67,16.51 280.35,16.19 v250.19,16.19 | v247.65,7.3 188.59,7.3 185.1,10.79 174.31,10.79 173.35,9.84 161.29,9.84 160.02,8.57 140.97,8.57 140.65,8.89 115.57,8.89 114.94,8.26 v112.71,8.26 | v110.49,23.18 v56.2,23.18
!MH0  (via drill 0.61)
  Top 0.254: E8.2 219.07,72.71 219.71,72.71 220.66,71.75 224.79,71.75 224.79,76.52 228.28,80.01 E8.9 | v343.54,78.74 349.25,78.74 349.25,82.23 350.2,83.19 356.87,83.19 356.87,65.72 360.36,62.23 E21.9
  Bottom 0.254: 376.87,62.87 362.27,62.87 361.31,61.91 E21.9 | 376.87,62.87 377.82,61.91 E20.12 | 376.87,62.87 387.03,62.87 387.99,61.91 E20.8 | v343.54,78.74 282.89,78.74 281.62,77.47 262.25,77.47 260.67,79.06 241.94,79.06 241.62,78.74 230.82,78.74 229.24,80.33 E8.9
!MSIRDIS  (via drill 0.61)
  Top 0.254: v277.5,65.09 277.5,63.82 279.08,62.23 E31.11 | v267.02,66.36 262.89,70.48 262.89,84.77 v263.21,85.09 | v187.01,85.09 184.15,82.23 184.15,77.79 183.2,76.83 180.34,76.83 180.34,82.23 175.26,87.31 v175.26,87.63 | v106.68,89.22 99.69,82.23 80.01,82.23 80.01,80.33 79.06,79.38 J2.2
  Bottom 0.254: v277.5,65.09 276.23,66.36 v267.02,66.36 | v187.01,85.09 v263.21,85.09 | v175.26,87.63 173.99,88.9 107,88.9 v106.68,89.22
!PANLOCK  (via drill 0.61)
  Top 0.254: v312.42,76.52 327.02,61.91 E24.13 | v261.3,76.83 260.67,77.47 v260.67,87.95 | v193.36,88.9 186.69,82.23 186.69,78.74 184.15,76.2 184.15,71.44 180.66,67.94 180.66,58.42 179.07,56.83 v179.07,47.31 | v175.26,47.31 168.91,40.96 168.91,20.64 161.29,13.02 161.29,12.38 153.67,4.76 119.7,4.76 v119.7,5.71 | v98.11,8.89 93.34,13.65 93.34,15.56 80.33,28.57 80.33,71.75 73.98,78.11 J2.6
  Bottom 0.254: v312.42,76.52 312.1,76.2 266.38,76.2 265.75,76.83 v261.3,76.83 | v260.67,87.95 259.71,88.9 v193.36,88.9 | v179.07,47.31 v175.26,47.31 | v119.7,5.71 106.36,5.71 103.19,8.89 v98.11,8.89 | R31.1 6.99,78.42 8.57,76.83 71.44,76.83 73.03,78.42 J2.6
!PULSELOADADD  (via drill 0.61)
  Top 0.254: v276.86,67.94 280.67,64.14 280.67,55.56 281.62,54.61 E31.7 | v250.82,68.9 247.65,72.07 v247.65,78.11 | v202.88,78.74 201.93,77.79 201.93,49.21 194.31,41.59 v194.31,35.88 | v152.4,32.38 151.13,31.11 151.13,16.19 148.59,13.65 148.59,9.84 144.46,5.71 120.65,5.71 120.65,6.67 115.57,11.75 v115.57,16.83 | v33.66,22.86 31.75,24.77 31.75,77.15 30.8,78.11 J2.40
  Bottom 0.254: v276.86,67.94 275.91,68.9 v250.82,68.9 | v247.65,78.11 222.88,78.11 222.25,78.74 v202.88,78.74 | v194.31,35.88 193.36,34.92 185.1,34.92 184.15,33.97 184.15,32.38 v152.4,32.38 | v115.57,16.83 115.25,17.14 58.74,17.14 53.02,22.86 v33.66,22.86
!RUN  (via drill 0.61)
  Top 0.254: R28.1 8.26,12.7 9.53,11.43 58.1,11.43 v58.1,16.51 58.1,37.47 J1.18 | v331.47,24.13 331.47,33.97 336.55,39.05 336.55,51.12 335.6,52.07 E24.5 | v272.1,22.86 270.51,21.27 270.51,11.75 v267.65,8.89 | v197.49,8.89 196.85,9.53 v196.85,18.41 | v171.13,20 167.96,16.83 167.96,14.61 166.37,13.02 v166.37,8.89 | v104.78,4.76 99.69,9.84 v99.69,16.19
  Bottom 0.254: v331.47,24.13 331.15,24.45 297.18,24.45 295.59,22.86 v272.1,22.86 | v197.49,8.89 v267.65,8.89 | v196.85,18.41 190.18,18.41 189.55,19.05 188.91,19.05 188.28,18.41 185.1,18.41 184.15,19.37 184.15,20.95 173.35,20.95 172.4,20 v171.13,20 | v166.37,8.89 162.24,4.76 v104.78,4.76 | v99.69,16.19 99.38,16.51 v58.1,16.51
!SHLT
  Bottom 0.254: J3.5 142.88,74.61 143.83,75.56 154.94,75.56 156.84,73.66 158.12,73.66 158.75,74.3 158.75,75.56 180.34,75.56 182.25,73.66 E27.1
!SINGSTEP  (via drill 0.61)
  Top 0.254: v300.99,49.85 300.99,54.29 301.31,54.61 301.31,59.05 301.94,59.69 E28.13 | v296.23,48.58 293.37,45.72 v293.37,36.51 | v259.71,35.88 258.44,34.61 258.44,16.83 255.27,13.65 255.27,11.75 247.65,4.13 193.68,4.13 193.68,9.84 191.77,11.75 191.77,14.61 194.31,17.14 v194.31,24.45 | v182.25,24.45 179.39,21.59 v179.39,18.1 | v77.15,22.23 64.77,34.61 64.77,77.15 63.82,78.11 J2.14
  Bottom 0.254: v300.99,49.85 299.72,48.58 v296.23,48.58 | v293.37,36.51 292.74,35.88 v259.71,35.88 | v194.31,24.45 193.99,24.13 182.56,24.13 v182.25,24.45 | v179.39,18.1 179.07,18.41 153.99,18.41 150.18,22.23 136.84,22.23 135.89,21.27 135.89,18.41 131.76,18.41 130.81,19.37 130.81,20.32 124.14,20.32 122.24,18.41 113.98,18.41 113.03,19.37 113.03,22.23 v77.15,22.23
!SRDATA  (via drill 0.61)
  Top 0.254: 41.91,81.6 41.91,80.33 42.86,79.38 J2.30 | 41.91,81.6 40.64,82.87 13.02,82.87 13.02,36.2 R30.2 12.38,34.92 12.38,27.94 10.48,26.04 R29.1 | v222.57,64.45 222.57,66.04 216.22,72.39 E8.1 215.58,72.39 213.68,70.48 213.68,67.31 v213.04,66.67 | v298.45,56.83 298.45,42.86 297.5,41.91 E32.13 | 41.91,81.6 44.45,84.14 91.12,84.14 92.08,83.19 99.69,83.19 v99.69,87.95 | v160.02,92.08 168.91,83.19 v168.91,62.55
  Bottom 0.254: v222.57,64.45 223.52,63.5 248.6,63.5 250.19,61.91 250.19,59.37 249.87,59.37 249.24,58.74 249.24,56.52 298.13,56.52 v298.45,56.83 | v99.69,87.95 103.82,92.08 v160.02,92.08 | v168.91,62.55 169.23,62.23 175.58,62.23 177.16,63.82 177.16,65.41 188.28,65.41 189.55,66.67 v213.04,66.67
!STATE  (via drill 0.61)
  Top 0.254: v251.78,58.1 250.19,56.52 v250.19,28.89 | v213.68,27.62 211.46,25.4 211.46,24.13 210.82,23.5 v202.56,23.5 | v180.34,23.81 178.44,21.91 178.44,10.16 v178.75,9.84 | v111.76,2.86 102.87,11.75 102.87,14.61 100.33,17.14 98.74,17.14 v98.74,46.99 | v33.34,74.61 33.34,78.11 J2.38
  Bottom 0.254: v251.78,58.1 252.09,58.1 253.68,59.69 E34.11 | v250.19,28.89 249.87,28.57 223.2,28.57 222.25,27.62 v213.68,27.62 | v202.56,23.5 201.93,24.13 198.44,24.13 197.8,23.5 180.66,23.5 v180.34,23.81 | v178.75,9.84 171.77,2.86 v111.76,2.86 | v98.74,46.99 88.27,57.47 50.48,57.47 v33.34,74.61
!STHIS  (via drill 0.61)
  Top 0.254: v278.13,78.42 278.13,84.45 381,84.45 382.27,83.19 382.27,60.01 376.56,54.29 E20.2 | v259.71,80.01 257.81,81.92 257.81,82.23 254,86.04 v224.16,86.04 | v195.58,86.04 191.77,82.23 191.77,77.15 189.23,74.61 189.23,66.99 184.15,61.91 184.15,52.07 182.25,50.16 v182.25,47.31 | v162.88,46.35 161.29,47.94 161.29,66.04 156.21,71.12 156.21,86.68 156.53,87 156.53,90.49 154.94,92.08 135.89,92.08 135.89,79.06 139.38,75.56 139.38,74.93 J3.4
  Bottom 0.254: v278.13,78.42 277.81,78.74 261.94,78.74 260.67,80.01 v259.71,80.01 | v195.58,86.04 v224.16,86.04 | v182.25,47.31 181.29,46.35 v162.88,46.35
!TS1  (via drill 0.61)
  Top 0.254: J1.26 47.94,37.47 46.04,35.56 46.04,28.26 31.75,13.97 10.48,13.97 10.48,13.34 R26.1 | v343.54,8.89 343.54,29.84 343.22,30.16 343.22,63.5 339.41,63.5 338.14,62.23 E24.9 | v278.45,8.89 276.54,10.79 270.51,10.79 v270.51,9.84 | v215.58,9.84 207.01,18.41 207.01,21.27 206.06,22.23 200.03,22.23 200.03,27.62 197.49,30.16 195.9,30.16 v195.9,29.21 | v177.16,29.84 176.53,30.48 v176.53,33.97
  Bottom 0.254: E24.9 338.45,61.91 339.41,62.87 356.55,62.87 357.5,61.91 E21.10 358.77,60.01 361,57.78 384.81,57.78 384.81,52.39 383.86,51.44 380.05,51.44 379.1,52.39 E20.3 | R27.2 5.71,12.38 6.67,11.43 8.57,11.43 9.53,12.38 R26.1 | v278.45,8.89 v343.54,8.89 | v215.58,9.84 v270.51,9.84 | v195.9,29.21 190.18,29.21 189.55,29.84 v177.16,29.84 | v176.53,33.97 173.99,36.51 134.3,36.51 133.99,36.83 90.49,36.83 85.41,41.91 68.26,41.91 67.31,40.96 67.31,40.01 66.99,40.01 66.36,39.37 65.72,39.37 64.77,38.42 64.77,36.2 50.48,36.2 48.9,37.78 J1.26
ADDR0  (via drill 0.61)
  Top 0.254: v129.22,41.59 129.54,41.91 129.54,52.7 128.27,53.98 128.27,56.83 128.59,57.15 128.59,58.74 128.27,59.05 v128.27,84.14 | v146.69,84.77 149.22,82.23 J3.9
  Bottom 0.254: v129.22,41.59 128.91,41.91 122.87,41.91 122.56,41.59 E18.9 | v128.27,84.14 129.22,85.09 133.99,85.09 134.62,84.45 146.37,84.45 v146.69,84.77
ADDR1  (via drill 0.61)
  Top 0.254: v126.68,55.24 v126.68,77.79 | v142.24,77.79 J3.12
  Bottom 0.254: v126.68,55.24 120.97,55.24 120.02,54.29 E17.7 | v126.68,77.79 127,77.47 141.92,77.47 v142.24,77.79
ADDR2  (via drill 0.61)
  Top 0.254: v118.11,75.25 118.11,59.05 119.7,59.05 120.65,60.01 121.28,60.01 E17.9 | v147,77.15 147,80.01 J3.10
  Bottom 0.254: v118.11,75.25 119.7,76.83 146.69,76.83 v147,77.15
BEMA0
  Bottom 0.254: J3.14 137.79,80.33 138.75,79.38 156.21,79.38 156.84,78.74 177.48,78.74 178.12,79.38 181.61,79.38 182.25,78.74 193.36,78.74 194.94,80.33 E27.10
BEMA1  (via drill 0.61)
  Top 0.254: v134.94,85.41 134.94,82.55 J3.15 | v178.75,85.09 181.61,82.23 181.61,79.06 v182.88,77.79
  Bottom 0.254: v134.94,85.41 135.25,85.72 153.03,85.72 153.67,85.09 v178.75,85.09 | v182.88,77.79 183.2,78.11 197.8,78.11 200.03,80.33 E27.8
BEMA2  (via drill 0.61)
  Top 0.254: v152.72,82.23 152.72,85.72 144.46,85.72 140.97,82.23 140.34,82.23 J3.13 | v176.53,79.69 177.16,79.69 v178.44,78.42 | v187.64,77.15 190.18,79.69 190.18,80.01 E27.12
  Bottom 0.254: v152.72,82.23 153.67,81.28 158.12,81.28 158.75,80.64 158.75,79.38 176.21,79.38 v176.53,79.69 | v178.44,78.42 178.75,78.11 181.29,78.11 182.56,76.83 187.32,76.83 v187.64,77.15
BPOK  (via drill 0.61)
  Top 0.254: E16.13 350.2,80.01 350.2,76.83 348.3,74.93 E16.1 v316.55,73.66 | E20.1 373.7,54.61 375.6,56.52 375.6,59.69 E20.13 375.6,62.23 375.6,66.04 v366.08,75.56 | v384.81,42.23 384.81,38.42 382.27,35.88 382.27,22.54 383.22,21.59 E23.10 | 214.63,30.8 214.63,19.37 214.95,19.05 214.95,14.61 215.58,13.97 E7.1 | 214.63,30.8 215.58,31.75 E6.1 | 214.63,30.8 214.63,51.12 215.58,52.07 E5.1 215.58,54.61 214.63,55.56 v214.63,66.04 v214.63,69.53 | 161.29,84.14 161.29,84.77 162.24,85.72 R32.1 | 161.29,84.14 161.29,80.33 160.66,79.69 160.66,75.25 160.34,74.93 E12.1 160.02,68.58 v161.61,66.99 | E15.1 131.76,13.97 130.81,14.92 130.81,22.54 132.08,23.81 E14.1 131.76,34.29 131.76,36.2 130.81,37.15 130.81,51.12 | 130.81,51.12 131.76,52.07 E13.1 | 130.81,51.12 v130.81,84.14 130.81,91.12 124.46,91.12 123.83,90.49 123.83,86.68 119.7,82.55 J4.10 | 161.29,84.14 v157.16,84.14 | v259.4,71.12 256.22,67.94 v256.22,66.36
  Bottom 0.254: v384.81,42.23 374.65,52.39 374.01,52.39 E20.1 | v366.08,75.56 349.57,75.56 348.62,74.61 E16.1 | v157.16,84.14 156.84,83.82 131.13,83.82 v130.81,84.14 | v214.63,69.53 214.31,69.85 192.72,69.85 192.09,69.22 172.4,69.22 170.18,66.99 v161.61,66.99 | v316.55,73.66 316.23,73.34 297.5,73.34 295.27,71.12 v259.4,71.12 | v256.22,66.36 227.01,66.36 226.69,66.04 v214.63,66.04
BRUN  (via drill 0.61)
  Top 0.254: E32.4 301.94,31.75 300.99,30.8 300.99,14.92 300.04,13.97 E33.3 300.36,11.75 v302.26,9.84 | v120.97,79.38 126.05,74.3 126.05,55.88 125.73,55.56 v125.73,50.48 | v286.7,47.62 289.24,45.09 v289.24,34.92 | v340.36,9.84 340.36,49.85 338.14,52.07 E24.6
  Bottom 0.254: v120.97,79.38 115.89,79.38 114.94,80.33 J4.12 | v125.73,50.48 138.43,50.48 138.75,50.8 150.5,50.8 150.81,50.48 165.42,50.48 165.74,50.16 189.55,50.16 192.09,47.62 200.03,47.62 200.66,48.26 222.57,48.26 223.2,47.62 v286.7,47.62 | v289.24,34.92 291.15,33.02 292.74,33.02 293.37,33.66 293.37,34.92 300.67,34.92 301.62,33.97 E32.4 | v302.26,9.84 v340.36,9.84 360.68,9.84 362.58,11.75 E26.7
BUS0  (via drill 0.61)
  Top 0.254: E11.3 190.18,13.97 190.18,19.05 E11.18 189.87,19.37 189.23,19.37 185.1,15.24 179.39,15.24 v179.39,13.65 | R9.1 R21.2 | E15.3 137.48,13.97 138.43,14.92 v138.43,28.89 138.43,30.8 137.48,31.75 E14.3
  Bottom 0.254: v138.43,28.89 138.11,29.21 135.57,29.21 134.3,27.94 122.87,27.94 122.56,27.62 48.9,27.62 38.73,37.78 J1.34 | R9.1 172.09,12.7 170.18,10.79 138.75,10.79 137.79,11.75 E15.3 | v179.39,13.65 178.44,12.7 R21.2
BUS1  (via drill 0.61)
  Top 0.254: E10.18 190.18,39.37 190.18,34.29 E10.3 189.87,32.07 v188.59,30.8 | E15.13 139.38,21.59 139.38,31.11 138.43,32.07 138.43,38.42 139.38,39.37 E14.13 | v135.25,45.4 139.06,41.59 E14.13 | v142.56,37.47 140.34,39.69 E14.13
  Bottom 0.254: R5.1 R17.2 175.9,30.48 176.21,30.8 v188.59,30.8 | v135.25,45.4 134.94,45.09 79.06,45.09 78.74,45.4 34.29,45.4 34.29,40.32 35.24,39.37 35.24,38.73 J1.36 | v142.56,37.47 150.81,37.47 155.26,41.91 184.15,41.91 184.15,39.69 185.1,38.73 188.91,38.73 189.87,39.69 E10.18
BUS2  (via drill 0.61)
  Top 0.254: E9.3 190.18,54.61 190.18,59.69 E9.18 190.5,69.85 v190.18,70.17 | v172.72,70.17 E12.6 | v140.97,44.77 144.46,48.26 144.46,52.07 E13.6
  Bottom 0.254: v172.72,70.17 173.04,70.48 189.87,70.48 v190.18,70.17 | E13.6 145.41,54.29 146.37,55.24 164.78,55.24 166.37,53.66 166.37,52.39 167,52.39 167.32,52.07 170.81,52.07 172.09,53.34 R15.1 R3.2 184.15,53.34 184.15,54.29 185.1,55.24 188.91,55.24 189.87,54.29 E9.3 | v140.97,44.77 140.02,43.81 36.83,43.81 36.83,37.78 35.88,36.83 34.61,36.83 33.66,37.78 J1.38
BUS3  (via drill 0.61)
  Top 0.254: R10.1 R22.2 | E11.5 195.26,13.97 195.26,19.05 E11.16 | E15.4 140.02,13.97 140.97,14.92 v140.97,27.3 140.97,30.8 140.02,31.75 E14.4
  Bottom 0.254: R22.2 170.81,12.7 173.35,15.24 193.36,15.24 194.94,13.65 E11.5 | v140.97,27.3 123.19,27.3 122.87,26.99 41.91,26.99 31.11,37.78 J1.40 | R10.1 167,12.7 165.1,14.61 141.29,14.61 140.34,13.65 E15.4
BUS4  (via drill 0.61)
  Top 0.254: E10.5 195.26,34.29 195.26,39.37 E10.16 | v178.12,39.69 173.99,35.56 173.99,29.21 172.09,29.21 170.81,30.48 R18.2 | 136.84,30.16 136.84,31.11 135.89,32.07 135.89,38.42 136.84,39.37 E14.14 | 136.84,30.16 136.84,21.59 E15.14 136.84,19.05 136.84,14.61 135.89,13.65 135.89,10.48 v139.7,6.67 | v56.2,35.24 56.2,37.47 J1.20 | v133.35,30.16 136.84,30.16 | v152.4,5.71 158.75,12.06 158.75,13.02 166.37,20.64 166.37,28.57 167.64,29.84 R6.1
  Bottom 0.254: R6.1 R18.2 | v178.12,39.69 178.44,39.37 180.97,39.37 182.25,38.1 190.18,38.1 191.77,39.69 191.77,42.55 193.99,42.55 194.94,41.59 E10.16 | v56.2,35.24 60.33,31.11 102.87,31.11 103.5,30.48 133.03,30.48 v133.35,30.16 | v152.4,5.71 152.08,5.4 140.97,5.4 v139.7,6.67
BUS5  (via drill 0.61)
  Top 0.254: E9.5 195.26,54.61 195.26,59.69 E9.16 | R16.1 R4.2 170.18,53.98 171.45,55.24 171.45,79.06 172.4,80.01 E12.11 | v145.1,55.88 145.1,59.69 E13.11 v144.78,63.82 | v56.2,60.01 56.2,58.74 54.61,57.15 54.61,39.69 53.66,38.73 J1.22
  Bottom 0.254: v145.1,55.88 165.1,55.88 R16.1 | v56.2,60.01 59.69,63.5 133.03,63.5 134.94,65.41 143.19,65.41 v144.78,63.82 | E9.5 194.94,54.29 193.36,55.88 173.35,55.88 170.81,53.34 R4.2
BUS6  (via drill 0.61)
  Top 0.254: E11.7 200.34,13.97 v200.34,16.83 200.34,19.05 E11.14 | E14.6 145.1,31.75 145.1,30.16 146.05,29.21 146.05,14.92 145.1,13.97 E15.6 145.1,11.43 145.1,10.48 v145.73,9.84 | v160.02,9.84 160.02,10.16 R11.1 R23.2 165.1,14.29 v167,16.19
  Bottom 0.254: J1.8 71.75,37.78 72.71,36.83 82.87,36.83 87.95,31.75 103.19,31.75 103.82,31.11 143.19,31.11 144.15,32.07 E14.6 | v145.73,9.84 v160.02,9.84 | v200.34,16.83 200.03,16.51 167.32,16.51 v167,16.19
BUS7  (via drill 0.61)
  Top 0.254: v131.76,46.04 131.76,46.99 136.84,52.07 E13.3 137.48,54.61 v137.48,57.78 | v79.38,46.04 74.93,41.59 74.93,39.69 73.98,38.73 J1.6 | E10.14 200.34,39.37 200.34,34.29 E10.7 v200.66,28.26 | R7.1 R19.2 | v164.78,69.53 164.78,72.39 E12.3 | v152.72,69.53 152.08,68.9 152.08,57.47 | 152.08,57.47 152.08,33.97 153.99,32.07 v153.99,31.43 | v152.4,57.47 152.08,57.47
  Bottom 0.254: v79.38,46.04 v131.76,46.04 | v164.78,69.53 164.47,69.85 153.03,69.85 v152.72,69.53 | v153.99,31.43 154.31,31.75 160.66,31.75 161.93,30.48 R7.1 | v200.66,28.26 195.26,28.26 194.94,28.57 189.87,28.57 189.23,29.21 177.8,29.21 177.48,28.89 167.32,28.89 165.74,30.48 R19.2 | v137.48,57.78 152.08,57.78 v152.4,57.47
BUS8  (via drill 0.61)
  Top 0.254: E9.7 200.34,54.61 200.34,59.69 E9.14 | 140.97,65.09 140.02,64.14 140.02,62.23 E13.13 | v145.1,65.09 140.97,65.09 | R1.2 165.1,53.98 166.37,55.24 v166.37,64.45 166.37,79.06 167.32,80.01 E12.13 | v81.28,39.37 97.16,55.24 v97.16,68.9 | v137.16,79.06 140.97,75.25 140.97,65.09
  Bottom 0.254: v145.1,65.09 145.41,65.41 153.03,65.41 153.67,64.77 166.05,64.77 v166.37,64.45 | R13.1 R1.2 165.1,52.7 166.37,51.44 199.07,51.44 200.03,52.39 E9.7 | v81.28,39.37 67.63,39.37 66.67,38.42 J1.12 | v97.16,68.9 105.73,77.47 125.09,77.47 127,79.38 136.84,79.38 v137.16,79.06
BUS9  (via drill 0.61)
  Top 0.254: E11.9 E11.12 | E14.11 144.46,39.37 143.51,38.42 v143.51,29.53 143.51,22.54 144.46,21.59 E15.11 145.1,19.05 v145.1,15.56 | v71.75,28.89 71.75,34.61 68.9,37.47 J1.10
  Bottom 0.254: R12.1 R24.2 160.66,12.7 161.93,11.43 167.96,11.43 168.91,12.38 168.91,15.24 | 168.91,15.24 168.91,15.88 202.88,15.88 205.1,13.65 E11.9 | v71.75,28.89 72.39,28.26 122.24,28.26 122.56,28.57 133.99,28.57 135.25,29.84 143.19,29.84 v143.51,29.53 | 168.91,15.24 145.41,15.24 v145.1,15.56
BUS10  (via drill 0.61)
  Top 0.254: E10.12 E10.9 205.42,31.75 v201.93,28.26 | v156.21,51.44 156.21,32.38 157.48,31.11 R8.1 | v167.32,70.17 167.32,72.39 E12.4 | v151.45,69.53 151.13,69.22 v151.13,51.44 | v118.11,42.23 118.75,42.86 v118.75,47.94 | v139.38,49.21 139.38,52.07 E13.4
  Bottom 0.254: R8.1 R20.2 160.66,30.48 162.88,28.26 177.8,28.26 178.12,28.57 188.91,28.57 189.55,27.94 194.63,27.94 194.94,27.62 200.03,27.62 200.34,27.3 200.98,27.3 v201.93,28.26 | v156.21,51.44 v151.13,51.44 141.29,51.44 140.34,52.39 E13.4 | v167.32,70.17 167,70.48 152.4,70.48 v151.45,69.53 | v118.11,42.23 117.79,42.55 64.77,42.55 64.77,40.32 63.82,39.37 62.55,39.37 61.59,38.42 J1.16 | v118.75,47.94 119.7,48.9 139.06,48.9 v139.38,49.21
BUS11  (via drill 0.61)
  Top 0.254: E9.9 205.42,54.61 205.42,59.69 E9.12 | v159.7,58.42 160.02,58.1 R2.2 | v165.42,77.79 165.42,80.01 E12.14 | v178.75,77.15 179.71,76.2 v179.71,60.01 | v157.16,44.45 157.48,44.77 R14.1
  Bottom 0.254: R2.2 R14.1 | E13.14 137.79,60.01 139.38,58.42 v159.7,58.42 160.02,58.74 178.44,58.74 v179.71,60.01 181.29,58.42 203.52,58.42 205.1,60.01 E9.12 | v165.42,77.79 166.05,77.15 v178.75,77.15 | v157.16,44.45 155.89,43.18 59.69,43.18 59.69,37.78 60.64,36.83 61.91,36.83 62.87,37.78 J1.14
DISP0  (via drill 0.61)
  Top 0.254: E36.15 269.56,21.59 271.46,23.5 271.46,31.75 E35.3 | v247.65,50.48 247.65,58.74 246.7,59.69 E34.14 245.75,61.91 v242.25,65.41 | v256.54,50.48 260.67,46.35 v260.67,20.64 | v113.03,82.87 113.03,75.88 113.98,74.93 J4.5 | v153.67,86.36 153.67,62.23 v153.35,61.91
  Bottom 0.254: v247.65,50.48 v256.54,50.48 | v260.67,20.64 260.99,20.32 264.8,20.32 265.43,19.68 265.43,18.41 267.65,18.41 268.61,19.37 E36.15 | v113.03,82.87 116.52,86.36 v153.67,86.36 | v153.35,61.91 153.67,61.59 180.97,61.59 182.25,62.87 203.84,62.87 206.06,65.09 221.93,65.09 222.25,65.41 v242.25,65.41
DISP1  (via drill 0.61)
  Top 0.254: E36.5 276.54,13.97 275.59,14.92 v275.59,31.43 275.91,31.11 278.13,31.11 v278.13,54.93 | v115.89,70.17 115.89,71.75 116.52,72.39 J4.6 | v101.92,66.99 97.79,62.87 v97.79,13.65 | v147,6.99 155.57,15.56 155.57,26.99 158.75,30.16 158.75,35.24 163.83,40.32 163.83,42.86 173.99,53.02 173.99,66.04 v175.26,67.31 | v211.46,51.12 v211.46,67.63
  Bottom 0.254: v275.59,31.43 275.27,31.11 270.83,31.11 269.88,32.07 E35.2 | v115.89,70.17 112.71,66.99 v101.92,66.99 | v97.79,13.65 99.38,12.06 102.55,12.06 108.27,6.35 119.06,6.35 120.33,7.62 140.02,7.62 140.65,6.99 v147,6.99 | v175.26,67.31 211.14,67.31 v211.46,67.63 | v211.46,51.12 211.77,51.44 223.84,51.44 224.79,52.39 224.79,54.61 225.11,54.61 225.74,55.24 236.22,55.24 240.03,51.44 247.33,51.44 | 247.33,51.44 248.28,52.39 E34.4 | v278.13,54.93 277.81,55.24 266.38,55.24 265.43,54.29 265.43,51.44 247.33,51.44
DISP2  (via drill 0.61)
  Top 0.254: E36.2 268.92,13.97 267.97,14.92 267.97,30.8 267.02,31.75 E35.1 | v247.65,35.24 247.65,41.59 249.56,43.5 249.56,46.67 244.16,52.07 E34.2 243.52,52.07 243.52,50.48 v237.81,44.77 | v132.08,75.88 133.35,74.61 v133.35,55.24 | v140.97,47.31 v140.97,54.93 | v191.13,44.13 v188.91,46.35
  Bottom 0.254: v247.65,35.24 247.97,34.92 261.62,34.92 263.52,33.02 E35.1 | v132.08,75.88 121.28,75.88 120.02,74.61 J4.7 | v133.35,55.24 140.65,55.24 v140.97,54.93 | v140.97,47.31 141.29,46.99 162.24,46.99 163.51,48.26 187.01,48.26 v188.91,46.35 | v191.13,44.13 191.45,44.45 206.06,44.45 207.33,45.72 221.3,45.72 221.93,45.09 237.49,45.09 v237.81,44.77
DISPINH  (via drill 0.61)
  Top 0.254: v366.39,39.37 361.95,43.81 361.95,79.06 361,80.01 E16.9 | v116.84,76.52 120.65,80.33 120.65,82.23 v128.27,89.85 | v160.97,89.85 163.83,87 163.83,44.13 v163.19,43.5 | v187.64,43.81 187.96,44.13 187.96,46.67 188.91,47.62 196.85,47.62 196.85,63.18 199.39,65.72 v199.39,87 | v263.21,87 265.43,84.77 v265.43,75.88
  Bottom 0.254: v366.39,39.37 372.11,39.37 372.11,38.42 373.06,37.47 376.87,37.47 377.82,38.42 E22.12 | v116.84,76.52 114.3,76.52 112.39,74.61 J4.4 | v160.97,89.85 v128.27,89.85 | v163.19,43.5 163.51,43.81 v187.64,43.81 | v199.39,87 v263.21,87 | v265.43,75.88 265.75,75.56 343.22,75.56 345.76,78.11 357.82,78.11 360.05,80.33 E16.9
DISPLAY0  (via drill 0.61)
  Top 0.254: v125.09,32.07 125.09,31.11 120.65,31.11 118.11,28.57 118.11,19.37 118.43,19.05 118.43,14.61 119.06,13.97 E19.7 | v132.72,35.24 133.35,35.88 133.35,47.31 138.43,52.39 v138.43,62.55 | v148.27,62.87 147.64,63.5 147.64,72.39 J3.7
  Bottom 0.254: v125.09,32.07 126.05,33.02 130.18,33.02 130.81,33.66 130.81,35.24 v132.72,35.24 | v138.43,62.55 138.75,62.87 v148.27,62.87
DISPLAY1  (via drill 0.61)
  Top 0.254: v146.05,30.48 146.05,79.06 145.1,80.01 J3.11 | E19.9 v121.92,29.21
  Bottom 0.254: v121.92,29.21 133.67,29.21 134.94,30.48 v146.05,30.48
DISPLAY2  (via drill 0.61)
  Top 0.254: v125.09,69.53 125.41,69.22 125.41,56.2 124.78,55.56 124.78,50.16 125.09,49.85 125.09,39.69 119.7,34.29 E18.7 | v141.92,69.53 144.46,72.07 144.46,72.39 J3.6
  Bottom 0.254: v125.09,69.53 v141.92,69.53
E30PIN8  (via drill 0.61)
  Top 0.254: v339.41,41.27 339.41,40.01 336.55,37.15 336.55,22.54 335.6,21.59 E30.8 | E21.11 355.92,59.69 357.82,57.78 357.82,54.61 E21.5
  Bottom 0.254: v339.41,41.27 348.93,50.8 355.92,50.8 357.5,52.39 E21.5
E35-Y4
  Bottom 0.254: E35.11 280.04,41.59 280.99,42.55 298.13,42.55 299.08,41.59 E32.12
ENT0  (via drill 0.61)
  Top 0.254: v204.79,15.24 203.52,13.97 E11.8
  Bottom 0.254: v204.79,15.24 206.38,16.83 220.34,16.83 222.88,19.37 E7.13 224.16,21.27 225.11,22.23 242.25,22.23 | 242.25,22.23 243.21,21.27 E3.13 | 242.25,22.23 270.19,22.23 271.14,21.27 E36.14
ENT1  (via drill 0.61)
  Top 0.254: v204.79,36.51 204.79,35.56 203.52,34.29 E10.8 | v220.98,37.78 222.88,39.69 E6.13 | v272.1,17.14 272.1,15.88 274,13.97 E36.4 | v252.09,17.14 250.19,19.05 250.19,21.27 248.6,22.86 242.57,22.86 242.57,38.42 243.52,39.37 E2.13
  Bottom 0.254: v204.79,36.51 205.1,36.2 219.39,36.2 v220.98,37.78 | E2.13 243.21,41.59 242.25,42.55 225.11,42.55 224.16,41.59 E6.13 | v252.09,17.14 v272.1,17.14
ENT2  (via drill 0.61)
  Top 0.254: E5.13 222.88,60.01 222.88,59.05 219.71,59.05 217.49,56.83 217.49,55.88 v216.85,55.24 217.17,54.93 217.17,44.45 219.71,41.91 | v237.81,12.7 232.41,18.1 232.41,21.59 226.06,27.94 219.71,27.94 219.71,41.91 | 219.71,41.91 229.87,52.07 229.87,54.29 232.41,56.83 232.41,63.18 240.03,70.8 240.03,77.15 243.21,80.33 E1.13
  Bottom 0.254: v216.85,55.24 214.63,55.24 214.63,53.98 214,53.34 212.72,53.34 210.82,55.24 204.79,55.24 203.84,54.29 E9.8 | v237.81,12.7 240.03,12.7 240.03,13.65 240.98,14.61 256.86,14.61 259.4,12.06 265.43,12.06 265.43,13.65 266.38,14.61 270.19,14.61 271.14,13.65 E36.3
GND
  pour GND$: 0,0 393.7,0 393.7,93.98 0,93.98
KEYSTB  (via drill 0.61)
  Top 0.254: v316.55,65.09 316.55,62.87 324.8,54.61 E24.1 | v226.38,66.99 226.38,72.39 E8.5
  Bottom 0.254: J4.2 107.31,72.71 108.9,71.12 223.84,71.12 225.43,72.71 E8.5 | v316.55,65.09 314.64,66.99 267.65,66.99 267.33,67.31 226.69,67.31 v226.38,66.99
LDSR  (via drill 0.61)
  Top 0.254: E5.9 234,59.69 234.95,58.74 234.95,43.5 234,42.55 234,41.91 E6.9 233.36,39.37 232.41,38.42 232.41,22.54 233.36,21.59 E7.9 234.31,21.27 v236.22,23.18 | v294,23.81 296.55,21.27 E33.13
  Bottom 0.254: v294,23.81 266.7,23.81 265.75,22.86 236.54,22.86 v236.22,23.18
MH0  (via drill 0.61)
  Top 0.254: v262.25,63.5 262.25,88.9 225.74,88.9 219.07,82.23 E8.13 | E22.11 381.32,40.64 381.63,40.96 381.63,49.21 384.81,52.39 384.81,58.74 385.76,59.69 E20.9
  Bottom 0.254: v262.25,63.5 388.3,63.5 389.89,61.91 389.89,59.05 387.67,59.05 386.71,60.01 E20.9
MPXA
  Top 0.254: 107.95,38.42 107.95,22.54 108.9,21.59 E19.14 | 107.95,38.42 108.9,39.37 E18.14 | 107.95,38.42 107.95,58.74 108.9,59.69 E17.14 109.54,62.23 110.49,63.18 110.49,79.06 109.54,80.01 J4.14
MPXB
  Top 0.254: E19.2 107,13.97 107.95,14.92 107.95,21.59 107,22.54 107,31.75 E18.2 106.36,34.29 105.41,35.24 105.41,51.12 106.36,52.07 E17.2 107,54.61 107,58.74 107.95,59.69 107.95,83.19 109.54,83.19 110.49,82.23 111.12,82.23 J4.13
N$1  (via drill 0.61)
  Top 0.254: v198.75,38.42 198.75,34.61 198.44,34.29 E10.6
  Bottom 0.254: v198.75,38.42 199.07,38.1 220.03,38.1 220.66,38.73 224.47,38.73 225.43,39.69 E6.12 226.69,39.69 228.28,38.1 244.16,38.1 245.75,39.69 E2.12
N$2  (via drill 0.61)
  Top 0.254: E5.12 225.74,59.69 225.74,56.83 v224.47,55.56 224.79,55.24 224.79,51.44 226.38,51.44 227.33,52.39 227.33,54.29 229.87,56.83 229.87,61.91 233.04,65.09 233.04,83.19 244.16,83.19 245.11,82.23 245.75,82.23 E1.12
  Bottom 0.254: v224.47,55.56 218.12,55.56 217.49,56.2 216.53,56.2 216.22,55.88 200.34,55.88 198.75,54.29 E9.6
N$3  (via drill 0.61)